# EAGLE schematic servo_distribute (EAGLE 9.6.2)
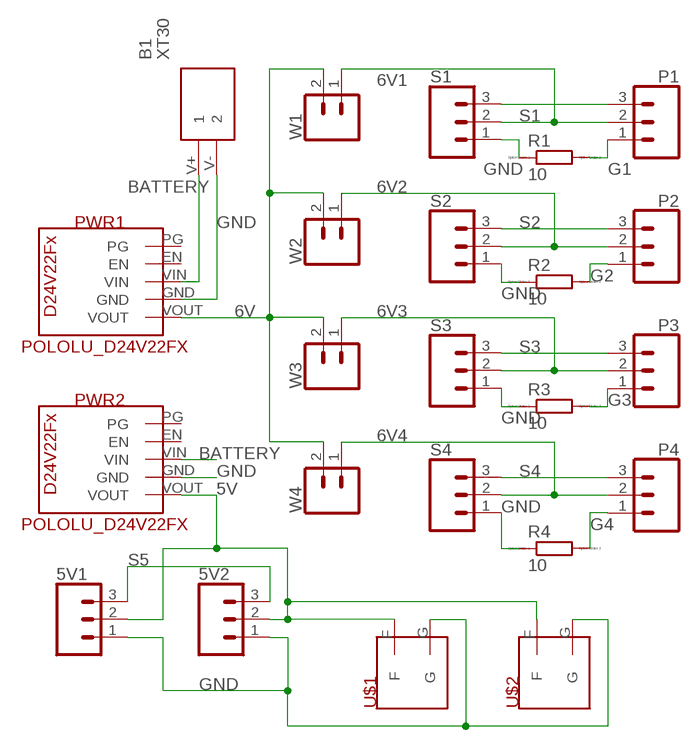
[diagram p0: schematic, sheet 1]

## Parts
5V1  CONN_03  [1X03]
5V2  CONN_03  [1X03]
B1  XT30  XT30PB  [XT30PB]
P1  CONN_03  [1X03]
P2  CONN_03  [1X03]
P3  CONN_03  [1X03]
P4  CONN_03  [1X03]
PWR1  POLOLU_D24V22FX  [POLOLU_D24V22F6]
PWR2  POLOLU_D24V22FX  [POLOLU_D24V22F6]
R1  10  RR1206  [R1206]
R2  10  RR1206  [R1206]
R3  10  RR1206  [R1206]
R4  10  RR1206  [R1206]
S1  CONN_03  [1X03]
S2  CONN_03  [1X03]
S3  CONN_03  [1X03]
S4  CONN_03  [1X03]
U$1  TERMINAL_3.5MM  [TERMINAL_3.5MM]
U$2  TERMINAL_3.5MM  [TERMINAL_3.5MM]
W1  CONN_02  [1X02]
W2  CONN_02  [1X02]
W3  CONN_02  [1X02]
W4  CONN_02  [1X02]

## Nets
5V: 5V1.2 5V2.2 PWR2.VOUT U$1.F U$2.F
6V: PWR1.VOUT W1.2 W2.2 W3.2 W4.2
6V1: P1.2 S1.2 W1.1
6V2: P2.2 S2.2 W2.1
6V3: P3.2 S3.2 W3.1
6V4: P4.2 S4.2 W4.1
BATTERY: B1.V+ PWR1.VIN PWR2.VIN
G1: P1.1 R1.2
G2: P2.1 R2.2
G3: P3.1 R3.2
G4: P4.1 R4.2
GND: 5V1.1 5V2.1 B1.V- PWR1.GND PWR2.GND R1.1 R2.1 R3.1 R4.1 S1.1 S2.1 S3.1 S4.1 U$1.G U$2.G
S1: P1.3 S1.3
S2: P2.3 S2.3
S3: P3.3 S3.3
S4: P4.3 S4.3
S5: 5V1.3 5V2.3
Unconnected: PWR1.EN PWR1.PG PWR2.EN PWR2.PG

## Library data of the parts
5V1 5V2 P1-P4 S1-S4 = SparkFun-Connectors:CONN_03: Multi connection point. Often used as Generic Header-pin footprint for 0.1 inch spaced/style header connections On any of the 0.1 inch spaced packages, you can populate with these: Break Away Headers - Straight <https://www.sparkfun.com/products/116> (PRT-00116) Break Away Male Headers - Right Angle <https://www.sparkfun.com/products/553> (PRT-00553) Female Headers <https://www.sparkfun.com/products/115> (PRT-00115) Break Away Headers - Machine Pin <https://www.sparkfun.com/products/117> (PRT-00117) Break Away Female Headers - Swiss Machine Pin <https://www.sparkfun.com/products/743> (PRT-00743) Stackable Header - 3 Pin (Female, 0.1") <https://www.sparkfun.com/products/13875> (PRT-13875) For SCREWTERMINALS and SPRING TERMINALS visit here: Screw Terimnals on SparkFun.com <https://www.sparkfun.com/search/results?term=Screw+Terminals> (5mm/3.5mm/2.54mm spacing) This device is also useful as a general connection point to wire up your design to another part of your project. Our various solder wires solder well into these plated through hole pads. Hook-Up Wire - Assortment (Stranded, 22 AWG) <https://www.sparkfun.com/products/11375> (PRT-11375) Hook-Up Wire - Assortment (Solid Core, 22 AWG) <https://www.sparkfun.com/products/11367> (PRT-11367) View the entire wire category on our website here <https://www.sparkfun.com/categories/141> Special notes: Molex polarized connector foot print use with SKU : PRT-08232 with associated crimp pins and housings.
B1 = XT30PB:XT30PB: Mini XT60 XT30 Connector for RC Multirotor Racing Drone Quadcopter Source: Datasheet <https://www.tme.eu/Document/4acc913878197f8c2e30d4b8cdc47230/XT30UPB SPEC.pdf>; DESCRIPTION: Mini XT60 XT30 Connector for RC Multirotor Racing Drone Quadcopter; HEIGHT: 10.7mm; MANUFACTURER_NAME: Amass; MANUFACTURER_PART_NUMBER: XT30PB
PWR1 PWR2 = chrand:POLOLU_D24V22FX: POLOLU Older package of D24V22F6 also called dj9251 (6V) and reg19a
R1-R4 = eagle-ltspice:R: RESISTOR, European symbol; SPICEMODEL: NONE; SPICEPREFIX: R
U$1 U$2 = chrand:TERMINAL_3.5MM: Small green screw terminal - from pololu motor controller
W1-W4 = SparkFun-Connectors:CONN_02: Multi connection point. Often used as Generic Header-pin footprint for 0.1 inch spaced/style header connections On any of the 0.1 inch spaced packages, you can populate with these: Break Away Headers - Straight <https://www.sparkfun.com/products/116> (PRT-00116) Break Away Male Headers - Right Angle <https://www.sparkfun.com/products/553> (PRT-00553) Female Headers <https://www.sparkfun.com/products/115> (PRT-00115) Break Away Headers - Machine Pin <https://www.sparkfun.com/products/117> (PRT-00117) Break Away Female Headers - Swiss Machine Pin <https://www.sparkfun.com/products/743> (PRT-00743) For SCREWTERMINALS and SPRING TERMINALS visit here: Screw Terimnals on SparkFun.com <https://www.sparkfun.com/search/results?term=Screw+Terminals> (5mm/3.5mm/2.54mm spacing) This device is also useful as a general connection point to wire up your design to another part of your project. Our various solder wires solder well into these plated through hole pads. Hook-Up Wire - Assortment (Stranded, 22 AWG) <https://www.sparkfun.com/products/11375> (PRT-11375) Hook-Up Wire - Assortment (Solid Core, 22 AWG) <https://www.sparkfun.com/products/11367> (PRT-11367) View the entire wire category on our website here <https://www.sparkfun.com/categories/141> Special notes: Molex polarized connector foot print use with: PRT-08233 with associated crimp pins and housings. 2.54_SCREWTERM for use with PRT-10571. 3.5mm Screw Terminal footprints for PRT-08084 5mm Screw Terminal footprints for use with PRT-08432